# EAGLE design Main_ATMEGA328P_SMD (EAGLE 6.4)
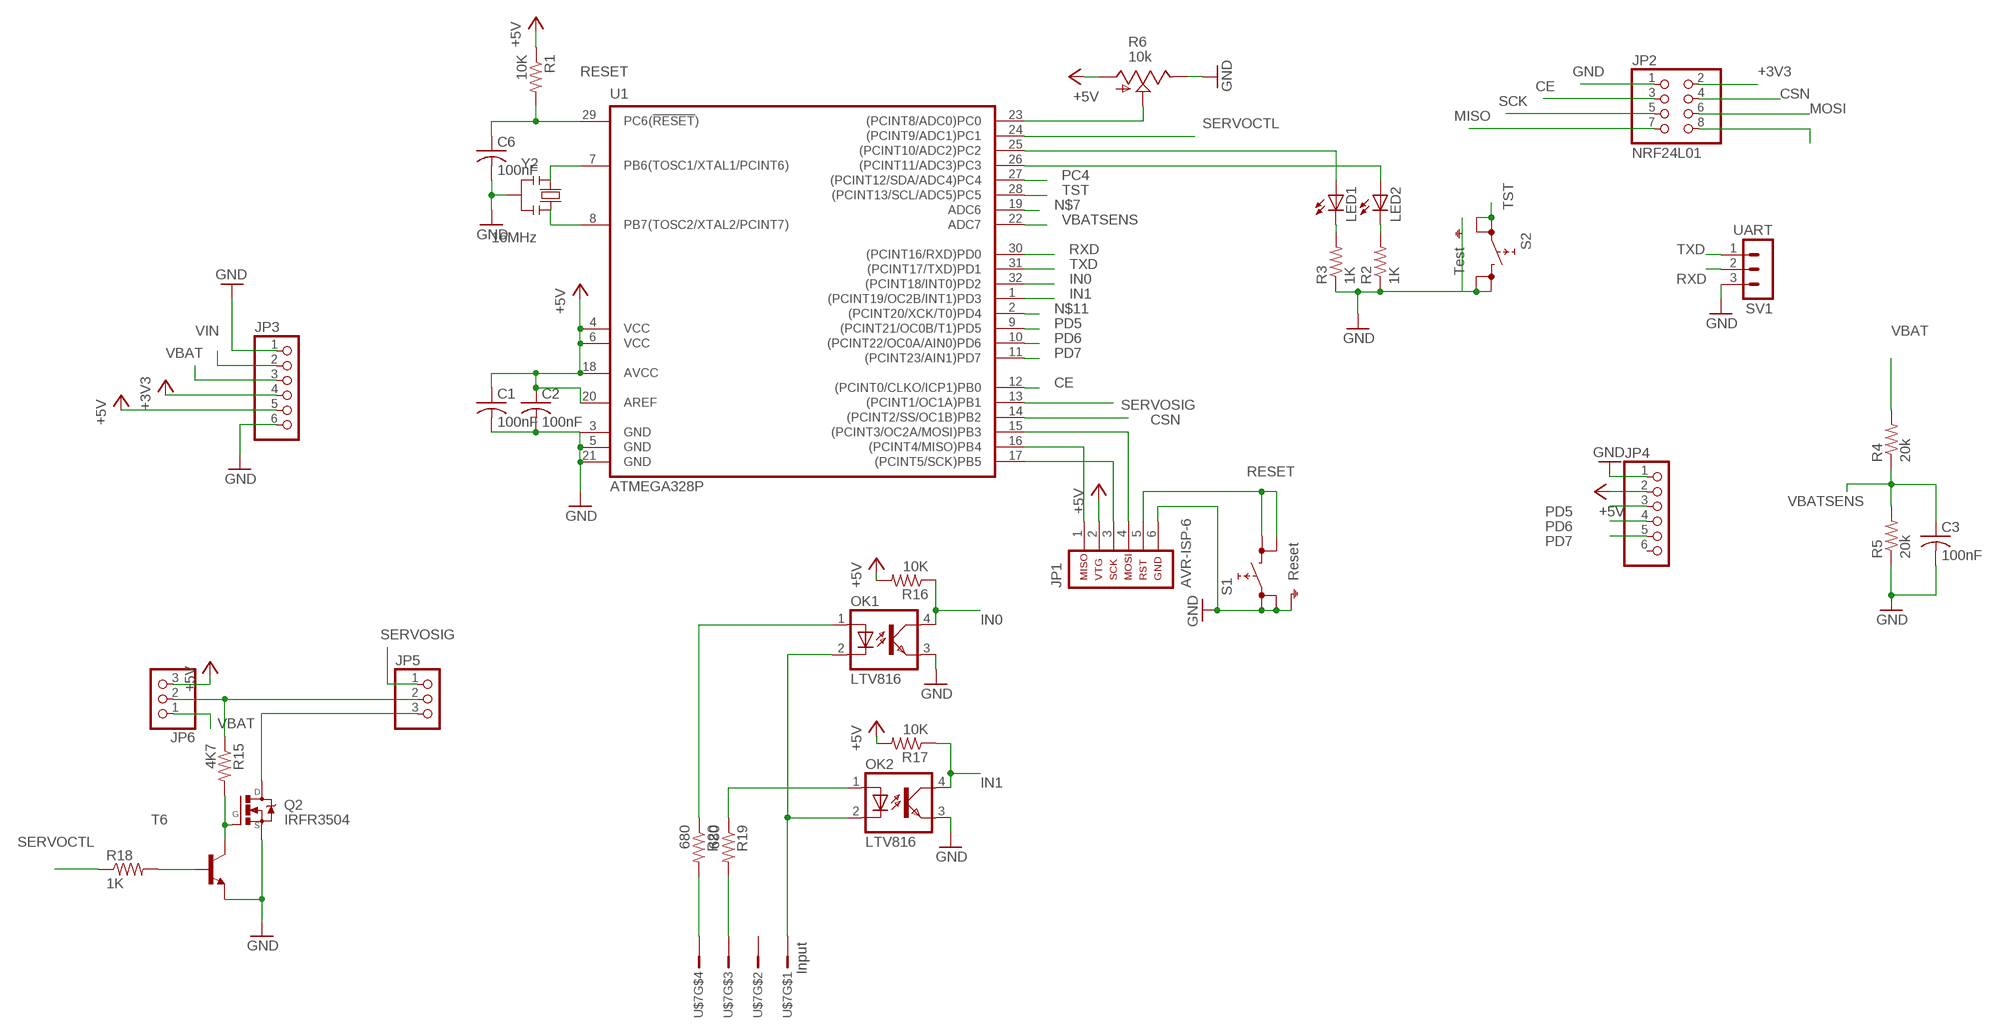
[diagram p0: schematic, sheet 1]

## Parts
C1  100nF  C-USC0805K  [C0805K]
C2  100nF  C-USC0805K  [C0805K]
C3  100nF  C-USC0805K  [C0805K]
C6  100nF  C-USC0805K  [C0805K]
JP1  AVR-ISP-6  [AVR-ISP-6]
JP2  NRF24L01  PINHD-2X4  [2X04]
JP3  PINHD-1X6  [1X06]
JP4  PINHD-1X6  [1X06]
JP5  PINHD-1X3  [1X03]
JP6  PINHD-1X3  [1X03]
LED1  LEDCHIPLED_0805  [CHIPLED_0805]
LED2  LEDCHIPLED_0805  [CHIPLED_0805]
OK1  LTV816  [DIL04]
OK2  LTV816  [DIL04]
Q2  IRFR3504  [DPAK]
R1  10K  R-US_R0805  [R0805]
R2  1K  R-US_R0805  [R0805]
R3  1K  R-US_R0805  [R0805]
R4  20k  R-US_R0805  [R0805]
R5  20k  R-US_R0805  [R0805]
R6  10k  TRIM_US-CT6  [CT6]
R15  4K7  R-US_R0805  [R0805]
R16  10K  R-US_R0805  [R0805]
R17  10K  R-US_R0805  [R0805]
R18  1K  R-US_R0805  [R0805]
R19  680  R-US_R0805  [R0805]
R20  680  R-US_R0805  [R0805]
S1  Reset  SKHMPSE010  [SKHMPXE010]
S2  Test  SKHMPSE010  [SKHMPXE010]
SV1  UART  MA03-1  [MA03-1]
T6  MMBT2222ALT1-NPN-SOT23-BEC  [SOT23-BEC]
U1  ATMEGA328P  ATMEGA48P/88P/168P/328P-A  [TQFP32A]
U$7  Input  JST_PHR-4  [PHR-4]
Y2  16MHz  RESONATORMU  [RESONATOR]

## Nets
+3V3: JP2.2 JP3.4
+5V: C1.1 C2.1 JP1.2 JP3.5 JP4.2 JP6.3 R1.1 R6.A R16.2 R17.2 U1.4(VCC) U1.6(VCC) U1.18(AVCC) U1.20(AREF)
CE: JP2.3 U1.12((PCINT0/CLKO/ICP1)PB0)
CSN: JP2.4 U1.14((PCINT2/SS/OC1B)PB2)
GND: C1.2 C2.2 C3.2 C6.2 JP1.6 JP2.1 JP3.1 JP3.6 JP4.1 OK1.3(EMIT) OK2.3(EMIT) Q2.3(S) R2.1 R3.1 R5.1 R6.E S1.1(1.1) S1.2(1.2) S1.5(SH) S2.3(2.1) S2.4(2.2) S2.5(SH) SV1.3 T6.E U1.5(GND) U1.21(GND) Y2.2
IN0: OK1.4(COL) R16.1 U1.32((PCINT18/INT0)PD2)
IN1: OK2.4(COL) R17.1 U1.1((PCINT19/OC2B/INT1)PD3)
MISO: JP1.1 JP2.7 U1.16((PCINT4/MISO)PB4)
MOSI: JP1.4 JP2.6 U1.15((PCINT3/OC2A/MOSI)PB3)
N$1: Q2.1(G) R15.2 T6.C
N$2: R6.S U1.23((PCINT8/ADC0)PC0)
N$3: LED1.A U1.25((PCINT10/ADC2)PC2)
N$4: LED2.A U1.26((PCINT11/ADC3)PC3)
N$5: JP2.8
N$6: R18.2 T6.B
N$7: U1.19(ADC6)
N$9: U1.8(PB7(TOSC2/XTAL2/PCINT7)) Y2.3
N$10: U1.7(PB6(TOSC1/XTAL1/PCINT6)) Y2.1
N$11: U1.2((PCINT20/XCK/T0)PD4)
N$12: LED2.C R2.2
N$13: LED1.C R3.2
N$18: JP5.2 JP6.2 R15.1
N$22: JP5.3 Q2.4(D)
N$24: OK1.2(C) OK2.2(C) U$7.P$1
N$33: R20.2 U$7.P$4
N$37: R19.2 U$7.P$3
N$39: OK1.1(A) R20.1
N$40: OK2.1(A) R19.1
PC4: U1.27((PCINT12/SDA/ADC4)PC4)
PD5: JP4.3 U1.9((PCINT21/OC0B/T1)PD5)
PD6: JP4.4 U1.10((PCINT22/OC0A/AIN0)PD6)
PD7: JP4.5 U1.11((PCINT23/AIN1)PD7)
RESET: C6.1 JP1.5 R1.2 S1.3(2.1) S1.4(2.2) U1.29(PC6(!RESET!))
RXD: SV1.2 U1.30((PCINT16/RXD)PD0)
SCK: JP1.3 JP2.5 U1.17((PCINT5/SCK)PB5)
SERVOCTL: R18.1 U1.24((PCINT9/ADC1)PC1)
SERVOSIG: JP5.1 U1.13((PCINT1/OC1A)PB1)
TST: S2.1(1.1) S2.2(1.2) U1.28((PCINT13/SCL/ADC5)PC5)
TXD: SV1.1 U1.31((PCINT17/TXD)PD1)
VBAT: JP3.3 JP6.1 R4.2
VBATSENS: C3.1 R4.1 R5.2 U1.22(ADC7)
VIN: JP3.2
Unconnected: JP4.6 U$7.P$2

## Power pins joined to a net without a drawn wire
GND: U1.3(GND)

## Library data of the parts
C1-C3 C6 = resistor:C-US: CAPACITOR, American symbol
JP1 = atmel:AVR-ISP-6: AVR ISP-6 Serial Programming Header
JP2 = pinhead:PINHD-2X4: PIN HEADER
JP3 JP4 = pinhead:PINHD-1X6: PIN HEADER
JP5 JP6 = pinhead:PINHD-1X3: PIN HEADER
LED1 LED2 = led:LED: LED OSRAM: - CHIPLED LG R971, LG N971, LY N971, LG Q971, LY Q971, LO R971, LY R971 LH N974, LH R974 LS Q976, LO Q976, LY Q976 LO Q996 - Hyper CHIPLED LW Q18S LB Q993, LB Q99A, LB R99A - SideLED LS A670, LO A670, LY A670, LG A670, LP A670 LB A673, LV A673, LT A673, LW A673 LH A674 LY A675 LS A676, LA A676, LO A676, LY A676, LW A676 LS A679, LY A679, LG A679 - Hyper Micro SIDELED® LS Y876, LA Y876, LO Y876, LY Y876 LT Y87S - SmartLED LW L88C, LW L88S LB L89C, LB L89S, LG L890 LS L89K, LO L89K, LY L89K LS L896, LA L896, LO L896, LY L896 - TOPLED LS T670, LO T670, LY T670, LG T670, LP T670 LSG T670, LSP T670, LSY T670, LOP T670, LYG T670 LG T671, LOG T671, LSG T671 LB T673, LV T673, LT T673, LW T673 LH T674 LS T676, LA T676, LO T676, LY T676, LB T676, LH T676, LSB T676, LW T676 LB T67C, LV T67C, LT T67C, LS T67K, LO T67K, LY T67K, LW E67C LS E67B, LA E67B, LO E67B, LY E67B, LB E67C, LV E67C, LT E67C LW T67C LS T679, LY T679, LG T679 LS T770, LO T770, LY T770, LG T770, LP T770 LB T773, LV T773, LT T773, LW T773 LH T774 LS E675, LA E675, LY E675, LS T675 LS T776, LA T776, LO T776, LY T776, LB T776 LHGB T686 LT T68C, LB T68C - Hyper Mini TOPLED® LB M676 - Mini TOPLED Santana® LG M470 LS M47K, LO M47K, LY M47K Source: http://www.osram.convergy.de LUXEON: - LUMILED® LXK2-PW12-R00, LXK2-PW12-S00, LXK2-PW14-U00, LXK2-PW14-V00 LXK2-PM12-R00, LXK2-PM12-S00, LXK2-PM14-U00 LXK2-PE12-Q00, LXK2-PE12-R00, LXK2-PE12-S00, LXK2-PE14-T00, LXK2-PE14-U00 LXK2-PB12-K00, LXK2-PB12-L00, LXK2-PB12-M00, LXK2-PB14-N00, LXK2-PB14-P00, LXK2-PB14-Q00 LXK2-PR12-L00, LXK2-PR12-M00, LXK2-PR14-Q00, LXK2-PR14-R00 LXK2-PD12-Q00, LXK2-PD12-R00, LXK2-PD12-S00 LXK2-PH12-R00, LXK2-PH12-S00 LXK2-PL12-P00, LXK2-PL12-Q00, LXK2-PL12-R00 Source: www.luxeon.com KINGBRIGHT: KA-3528ASYC Source: www.kingbright.com
OK1 OK2 = optocoupler:LTV816: OPTO COUPLER Source: LITEON, LTV816.pdf; OC_FARNELL: unknown; OC_NEWARK: unknown
Q2 = transistor-fet:IRFR3504: N-Channel HEXFET
R1-R5 R15-R20 = resistor:R-US_: RESISTOR, American symbol
R6 = pot:TRIM_US-: POTENTIOMETER
S1 S2 = switch:SKHMP*E010: 6.2 X 6.5mm TACT Switch (SMD) Source: http://www3.alps.co.jp/WebObjects/catalog.woa/PDF/E/Switch/Tact/SKHM/SKHM.PDF
SV1 = con-lstb:MA03-1: PIN HEADER; OC_FARNELL: unknown; OC_NEWARK: unknown
T6 = transistor:*-NPN-: NPN Transistror BF959 corrected 2008.03.06
U1 = atmel-avr:ATMEGA48P/88P/168P/328P: MICROCONTROLLER 4/8/16/32K Flash
U$7 = RobThePyro:JST_PHR-4
Y2 = SmartPrj:RESONATOR

## Net classes
0 default: width 0.152 mm, drill 0.305 mm, clearance 0.152 mm

## Board
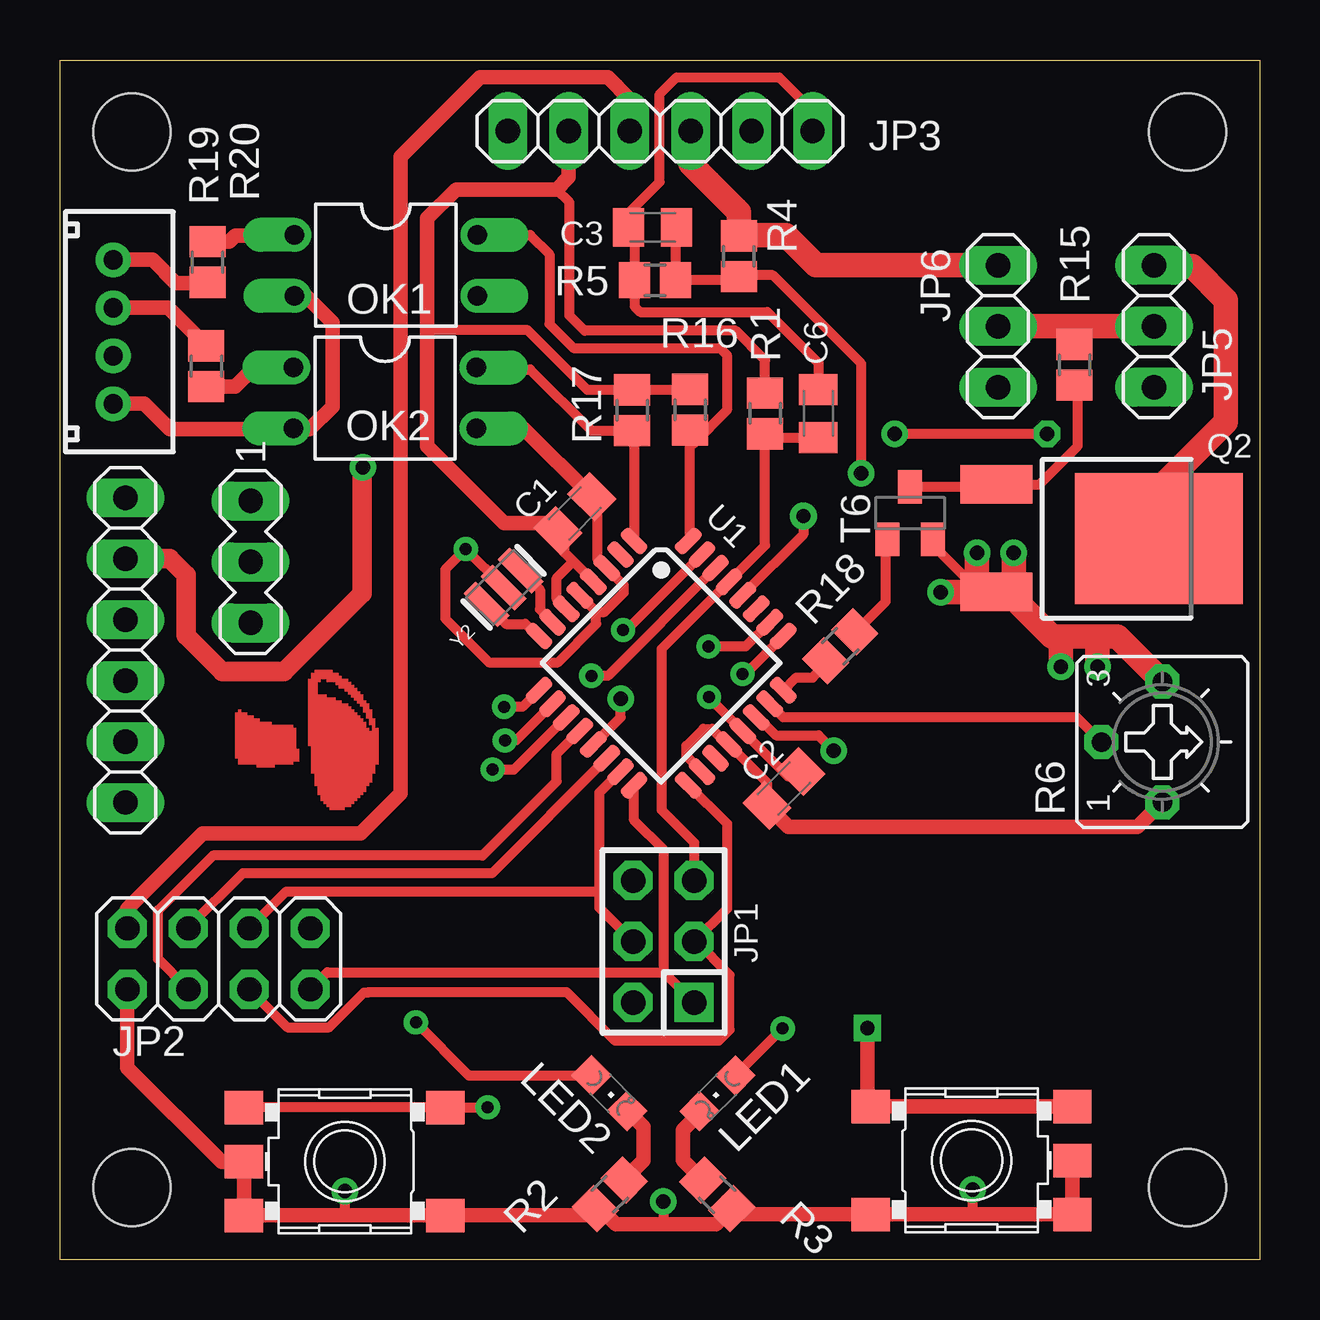
[diagram p1: board, top side]
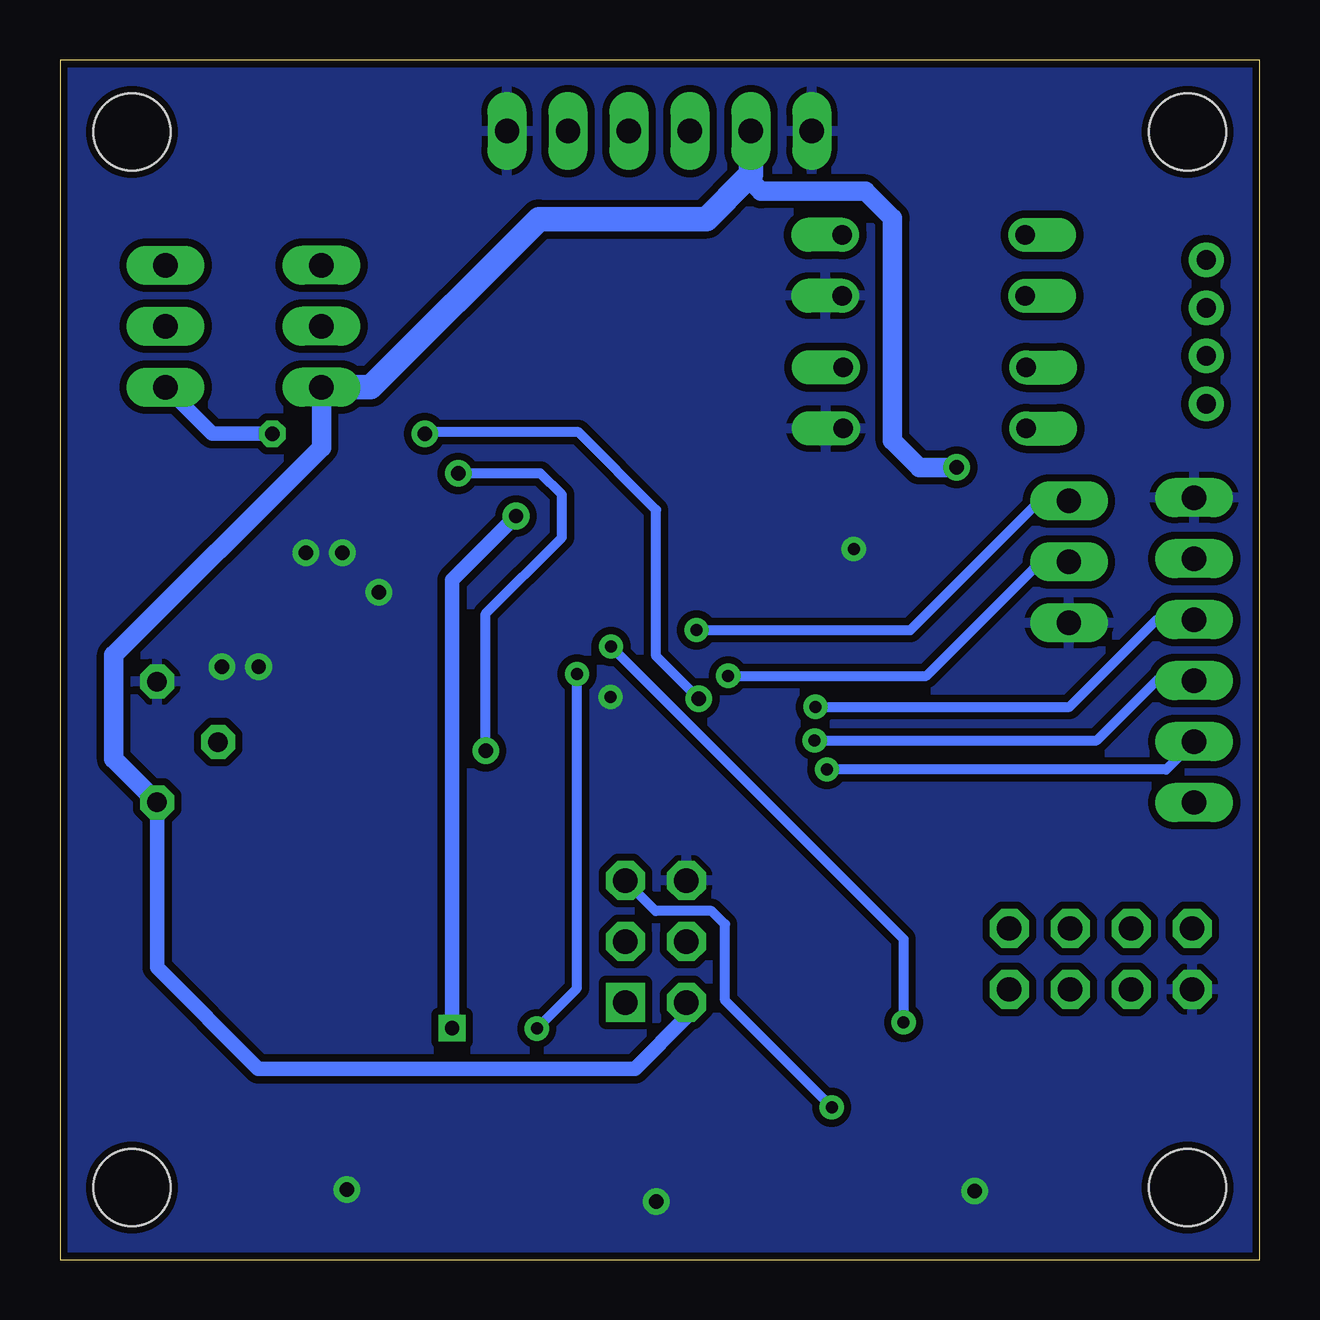
[diagram p2: board, bottom side, seen from below]

Size 50 x 50 mm. Coordinates in mm from the lower left corner, seen from the top.
Outline: 0,0 0,50 50,50 50,0 0,0
Copper layers (1*16): Top 0.035mm / dielectric 1.5mm / Bottom 0.035mm
Design rules "SparkFun": minimum track width 8mil, minimum drill 20mil, track to track 8mil, track to pad 8mil, pad to pad 8mil, via to via 8mil, smd to smd 8mil, copper to edge 10mil, drill to drill 8mil, minimum pad ring 12mil, minimum via ring 10mil, stop-mask expansion 4mil, vias tented up to drill 25mil, thermal gap 10mil
Holes 3.2 mm at 3,3 3,47 47,47 47,3

### Footprints (pad centres in the part's own frame; a part is rotated, then mirrored left to right if it is on the bottom)
C0805K = smd 1.3 x 1.6: 1 -1,0; 2 1,0
AVR-ISP-6 = drill 1.016 square: 1 -2.54,-1.27 | drill 1.016 octagon: 2 -2.54,1.27; 3 0,-1.27; 4 0,1.27; 5 2.54,-1.27; 6 2.54,1.27
2X04 = drill 1.016 octagon: 1 -3.81,-1.27; 2 -3.81,1.27; 3 -1.27,-1.27; 4 -1.27,1.27; 5 1.27,-1.27; 6 1.27,1.27; 7 3.81,-1.27; 8 3.81,1.27
1X06 = drill 1.016 long: 1 -6.35,0; 2 -3.81,0; 3 -1.27,0; 4 1.27,0; 5 3.81,0; 6 6.35,0
1X03 = drill 1.016 long: 1 -2.54,0; 2 0,0; 3 2.54,0
CHIPLED_0805 = smd 1.2 x 1.2: A 0,-1.05; C 0,1.05
DIL04 = drill 0.813 offset: 1 -1.27,-3.81; 2 1.27,-3.81; 3 1.27,3.81; 4 -1.27,3.81
DPAK = smd 1.6 x 2.997: 1 -2.261,-4.928; 3 2.21,-4.928 | smd 5.452 x 7: 4 0,1.853
R0805 = smd 1.3 x 1.5: 1 -0.85,0; 2 0.85,0
CT6 = drill 0.813 octagon: A 2.515,0; E -2.515,0; S 0,-2.54
SKHMPXE010 = smd 1.6 x 1.4: 1 -4.2,2.25; 2 4.2,2.25; 3 -4.2,-2.25; 4 4.2,-2.25; 5 4.2,0
MA03-1 = drill 1.016 long: 1 -2.54,0; 2 0,0; 3 2.54,0
SOT23-BEC = smd 1 x 1.4: B -0.95,-1.1; C 0,1.1; E 0.95,-1.1
TQFP32A = smd 1.27 x 0.559: 1 -4.4,2.8; 2 -4.4,2; 3 -4.4,1.2; 4 -4.4,0.4; 5 -4.4,-0.4; 6 -4.4,-1.2; 7 -4.4,-2; 8 -4.4,-2.8; 17 4.4,-2.8; 18 4.4,-2; 19 4.4,-1.2; 20 4.4,-0.4; 21 4.4,0.4; 22 4.4,1.2; 23 4.4,2; 24 4.4,2.8 | smd 0.559 x 1.27: 9 -2.8,-4.4; 10 -2,-4.4; 11 -1.2,-4.4; 12 -0.4,-4.4; 13 0.4,-4.4; 14 1.2,-4.4; 15 2,-4.4; 16 2.8,-4.4; 25 2.8,4.4; 26 2,4.4; 27 1.2,4.4; 28 0.4,4.4; 29 -0.4,4.4; 30 -1.2,4.4; 31 -2,4.4; 32 -2.8,4.4
PHR-4 = drill 0.8 pad 1.45: P$1 -3,0.5; P$2 -1,0.5; P$3 1,0.5; P$4 3,0.5
RESONATOR = smd 0.7 x 2: 1 -1,0; 2 0,0; 3 1,0

### Placement (x,y rotation side)
C1  21.46,31.09 45 top
C2  30.18,19.63 45 top
C3  24.7,43.02 180 top
C6  31.61,35.26 90 top
JP1  25.16,13.25 90 top
JP2  6.62,12.53 0 top
JP3  25.02,47.04 180 top
JP4  2.72,25.4 270 top
JP5  45.6,38.9 90 top
JP6  39.1,38.9 270 top
LED1  27.41,6.92 135 top
LED2  22.89,6.93 225 top
OK1  13.58,41.44 270 top
OK2  13.55,35.91 270 top
Q2  43.95,30.05 270 top
R1  29.39,35.27 270 top
R2  22.91,2.72 45 top
R3  27.39,2.72 135 top
R4  28.3,41.82 90 top
R5  24.8,40.82 0 top
R6  45.95,21.57 270 top
R15  42.29,37.29 270 top
R16  26.26,35.42 90 top
R17  23.84,35.4 90 top
R18  32.53,25.56 45 top
R19  6.1,37.24 90 top
R20  6.15,41.58 270 top
S1  11.87,4.09 180 top
S2  38,4.13 0 top
SV1  7.95,29.08 270 top
T6  35.43,31.11 0 top
U1  25.06,24.86 315 top
U$7  2.72,38.67 90 top
Y2  18.49,28.02 225 top

### Tracks (layer width: path | path; a pad name or v marks a point on that pad's centre or on a via)
+3V3
  Top 0.61: JP3.4 23.75,48.36 22.84,49.28 17.5,49.28 14.2,45.97 14.2,19.43 12.52,17.75 5.94,17.75 2.81,14.62 JP2.2
+5V  (via drill 0.6)
  Top 0.406: 21,29.9 21,29.49 21.44,29.04 | 21.44,29.04 U1.4 | U1.6 20.7,27.52 20.7,28.4 21.34,29.04 21.44,29.04 | R16.2 23.86,36.27 R17.2 21.98,36.25 19.49,38.73 15.43,38.73 15.3,38.86 | U1.18 26.11,20.98 26.11,21.41 26.82,22.12 27.18,22.12 27.84,21.47 U1.20 29.47,19.89 C2.1 | R1.1 29.39,37.48 28.17,38.71 21.87,38.71 21.23,39.34 21.23,44.07 20.7,44.6
  Top 0.61: JP3.5 21.2,45.1 20.7,44.6 16.5,44.6 15.3,43.4 15.3,38.86 15.3,33.9 18.5,30.7 20.2,30.7 21,29.9 21,30.14 C1.1 | C2.1 30.36,18.03 44.91,18.03 45.93,19.06 R6.A
  Top 0.813: JP4.2 4.57,29.21 5.26,28.52 5.26,26.01 6.76,24.51 9.35,24.51 12.6,27.76 12.6,32.99 v12.62,33.02
  Bottom 0.61: JP1.2 23.9,10.08 26.04,7.95 41.73,7.95 45.95,12.17 R6.A
  Bottom 0.813: R6.A 47.75,20.86 47.75,25.2 39.1,33.85 JP6.3 | v12.62,33.02 14.18,33.02 15.3,34.14 15.3,43.4 16.43,44.53 20.78,44.53 21.34,45.09
  Bottom 1.016: JP3.5 21.2,45.22 21.34,45.09 23.05,43.37 30.04,43.37 37.05,36.36 JP6.3
CE
  Top 0.406: JP2.3 4.09,12.52 4.09,14.55 6.38,16.84 17.61,16.84 20.7,19.93 20.7,21.08 21.65,22.03 U1.12
CSN
  Top 0.406: U1.14 18,16.1 7.62,16.1 5.35,13.83 JP2.4
GND  (via drill 0.5, 0.6)
  Top 0.406: C1.2 22.17,31.43 22.4,31.2 22.4,29.22 U1.3 22.8,28.8 23.5,28.1 23.5,27.8 22.7,27 22.35,27 U1.5 | v11.87,2.86 11.87,1.91 | v25.15,2.41 25.15,1.52 25.21,1.46 | v38.04,2.92 38.04,1.97 | C2.2 31.25,20.34 31.45,20.14 30.34,20.14 U1.21 v27.05,23.43 v27.05,23.44 | Y2.2 18.49,28.04 v16.92,29.62 16.05,28.75 16.05,26.72 17.88,24.89 20.75,24.89 22.35,26.49 22.35,26.98 | JP3.1 31.36,47.88 29.97,49.28 25.7,49.28 24.99,48.56 24.99,44.91 23.7,43.61 C3.2 23.95,42.77 R5.1 23.95,39.73 24.18,39.5 29.49,39.5 31.62,37.36 31.62,36.27 C6.2 | T6.E 36.38,29.78 38.1,28.07
  Top 0.61: C1.2 19.33,34.64 OK2.3 | JP2.1 2.81,7.98 6.73,4.06 7.64,4.06 S1.5 S1.2 S1.1 22.03,1.84 R2.1 22.52,2.12 23.18,1.46 25.21,1.46 27.34,1.46 R3.1 28.23,1.88 S2.3 S2.4 S2.5
  Top 1.016: R6.E 44.07,25.97 43.18,25.97 | 43.18,25.97 41.66,25.97 | 41.66,25.97 41.34,25.97 39.47,27.84 Q2.3 | v36.7,27.81 39.12,27.81 38.86,28.07 38.1,28.07 38.23,28.19 v38.23,29.46 | v39.75,29.46 39.75,27.94 39.62,27.81 | v43.24,24.7 43.24,25.91 43.18,25.97 | v41.72,24.7 41.72,25.91 41.66,25.97
  Bottom 0.406: v16.92,29.62 16.92,29.67 16.84,29.74 | v27.05,23.44 26.92,23.57
  pour Bottom (isolate 0.305): 0,50 0,0 50,0 50,50
IN0
  Top 0.406: U1.32 26.26,30.02 26.26,34 | 26.26,34 R16.1 | OK1.4 17.4,42.7 19.6,42.7 20.4,41.9 20.4,39 21.4,38 27.5,38 27.8,37.7 27.8,35.4 26.4,34 26.26,34
IN1
  Top 0.406: U1.1 23.93,34.47 R17.1 22.15,34.55 19.6,37.1 17.44,37.1 OK2.4
MISO
  Top 0.406: JP1.1 25.17,11.97 | 25.17,11.97 25.17,17.07 23.93,18.31 U1.16 | JP2.7 11.14,11.97 25.17,11.97
MOSI
  Top 0.406: U1.15 22.48,19.45 22.48,15.34 | 22.48,15.34 22.48,14.67 JP1.4 | JP2.6 9.43,15.34 22.48,15.34
N$1
  Top 0.406: T6.C 38.94,32.22 Q2.1 40.81,32.31 42.42,33.91 42.42,36.31 R15.2
N$2
  Top 0.406: U1.23 30.14,22.61 42.37,22.61 R6.S
N$3  (via drill 0.5)
  Top 0.406: LED1.A v30.11,9.63 v30.12,9.63 | v28.45,24.41 28.68,24.64 28.8,24.64 U1.25
  Bottom 0.406: v30.12,9.63 28.45,11.3 v28.45,24.41
N$4  (via drill 0.5)
  Top 0.406: U1.26 28.58,25.55 v27.03,25.55 | v14.83,9.88 17.04,7.67 LED2.A
  Bottom 0.406: v27.03,25.55 14.83,13.36 v14.83,9.88
N$6
  Top 0.406: R18.2 33.15,26.16 34.42,27.43 34.42,29.95 T6.B
N$9
  Top 0.406: Y2.3 18.59,26.5 19.4,26.5 19.91,25.99 U1.8
N$10
  Top 0.406: Y2.1 20,27.92 20,27.1 U1.7
N$12
  Top 0.61: R2.2 24.32,4.13 24.32,5.52 23.66,6.19 LED2.C
N$13
  Top 0.61: R3.2 25.97,4.14 25.97,5.4 26.67,6.09 LED1.C
N$18
  Top 0.406: R15.1 42.29,38.9
  Top 1.016: JP6.2 42.29,38.9 JP5.2
N$22
  Top 1.016: Q2.4 45.81,32.11 48.6,34.9 48.6,40 47.2,41.4 45.64,41.4 JP5.3
N$24
  Top 0.61: U$7.P$1 3.51,35.67 4.57,34.61 9.71,34.61 OK2.2 9.77,34.61 10.41,34.61 11.37,35.56 11.37,39.05 10.25,40.17 OK1.2
N$33
  Top 0.61: U$7.P$4 3.86,41.67 4.83,40.7 6.13,40.7 R20.2
N$37
  Top 0.61: U$7.P$3 4.52,39.67 R19.2
N$39
  Top 0.61: R20.1 7.06,42.42 7.3,42.67 9.73,42.67 OK1.1
N$40
  Top 0.61: R19.1 7.3,36.39 8.06,37.15 9.71,37.15 OK2.1
PD5  (via drill 0.5)
  Top 0.406: U1.9 19.28,23.04 v18.52,23.04
  Bottom 0.406: v18.52,23.04 7.92,23.04 4.32,26.64 2.75,26.64 JP4.3
PD6  (via drill 0.5)
  Top 0.406: U1.10 19.01,21.64 v18.54,21.64
  Bottom 0.406: v18.54,21.64 6.78,21.64 4.27,24.16 2.75,24.16 JP4.4
PD7  (via drill 0.5)
  Top 0.406: v18.03,20.42 18.92,20.42 U1.11
  Bottom 0.406: JP4.5 3.89,20.42 v18.03,20.42
RESET  (via drill 0.5)
  Top 0.406: JP1.5 26.43,17.38 25.08,18.73 25.08,25.45 U1.29 29.39,29.76 R1.2 29.55,34.26 C6.1 | S1.4 S1.3 v17.83,6.35
  Bottom 0.406: v17.83,6.35 22.28,10.79 22.28,13.97 22.84,14.53 25.17,14.53 JP1.5
RXD  (via drill 0.5)
  Top 0.406: U1.30 22.84,24.33 v22.15,24.33
  Bottom 0.406: v22.15,24.33 13.89,24.33 9.14,29.08 SV1.2
SCK
  Top 0.406: U1.17 26.2,19.77 27.81,18.16 27.81,14.63 JP1.3 26.52,13.25 27.91,11.86 27.91,9.58 27.46,9.12 23.14,9.12 21.11,11.15 12.85,11.15 12.83,11.12 12.68,11.12 11.23,9.68 9.47,9.68 JP2.5
SERVOCTL
  Top 0.406: R18.1 31.93,24.81 31.37,24.26 30.68,24.26 U1.24
SERVOSIG  (via drill 0.6)
  Top 0.406: U1.13 23.37,22.6 v23.37,23.37 | v34.8,34.42 v41.15,34.42
  Bottom 0.406: v23.37,23.37 25.15,25.15 25.15,31.24 28.38,34.48 34.73,34.48 v34.8,34.42
  Bottom 0.61: v41.15,34.42 43.66,34.42 JP5.1
TST  (via drill 0.6)
  Top 0.406: U1.28 30.99,30.22 v30.99,30.99
  Top 0.61: S2.2 S2.1 33.66,6.38 v33.66,9.65
  Bottom 0.61: v33.66,9.65 33.66,28.32 v30.99,30.99
TXD  (via drill 0.5)
  Top 0.406: U1.31 23.61,26.24 v23.47,26.24
  Bottom 0.406: v23.47,26.24 14.55,26.24 9.17,31.62 SV1.1
VBAT
  Top 1.016: JP3.3 26.29,45.67 28.3,43.66 R4.2 28.33,42.7 30.25,42.7 31.51,41.44 JP6.1
VBATSENS  (via drill 0.6)
  Top 0.406: C3.1 25.65,42.97 R5.2 28.15,40.82 R4.1 28.35,41.02 29.72,41.02 33.4,37.34 v33.4,32.77 | U1.22 29.09,22.6 29.84,21.84 31.62,21.84 v32.26,21.21
  Bottom 0.406: v32.26,21.21 32.26,26.92 29.08,30.1 29.08,31.88 29.97,32.77 v33.4,32.77
(copper drawn outside any net)
  shapes: Top area x62

### Text on the board
tValues: Gnd | Tx | 5V | Rx | PD5 | Gnd | PD4 | PD3